# Altium schematic sheet Schematic_CNC.SchDoc
size A
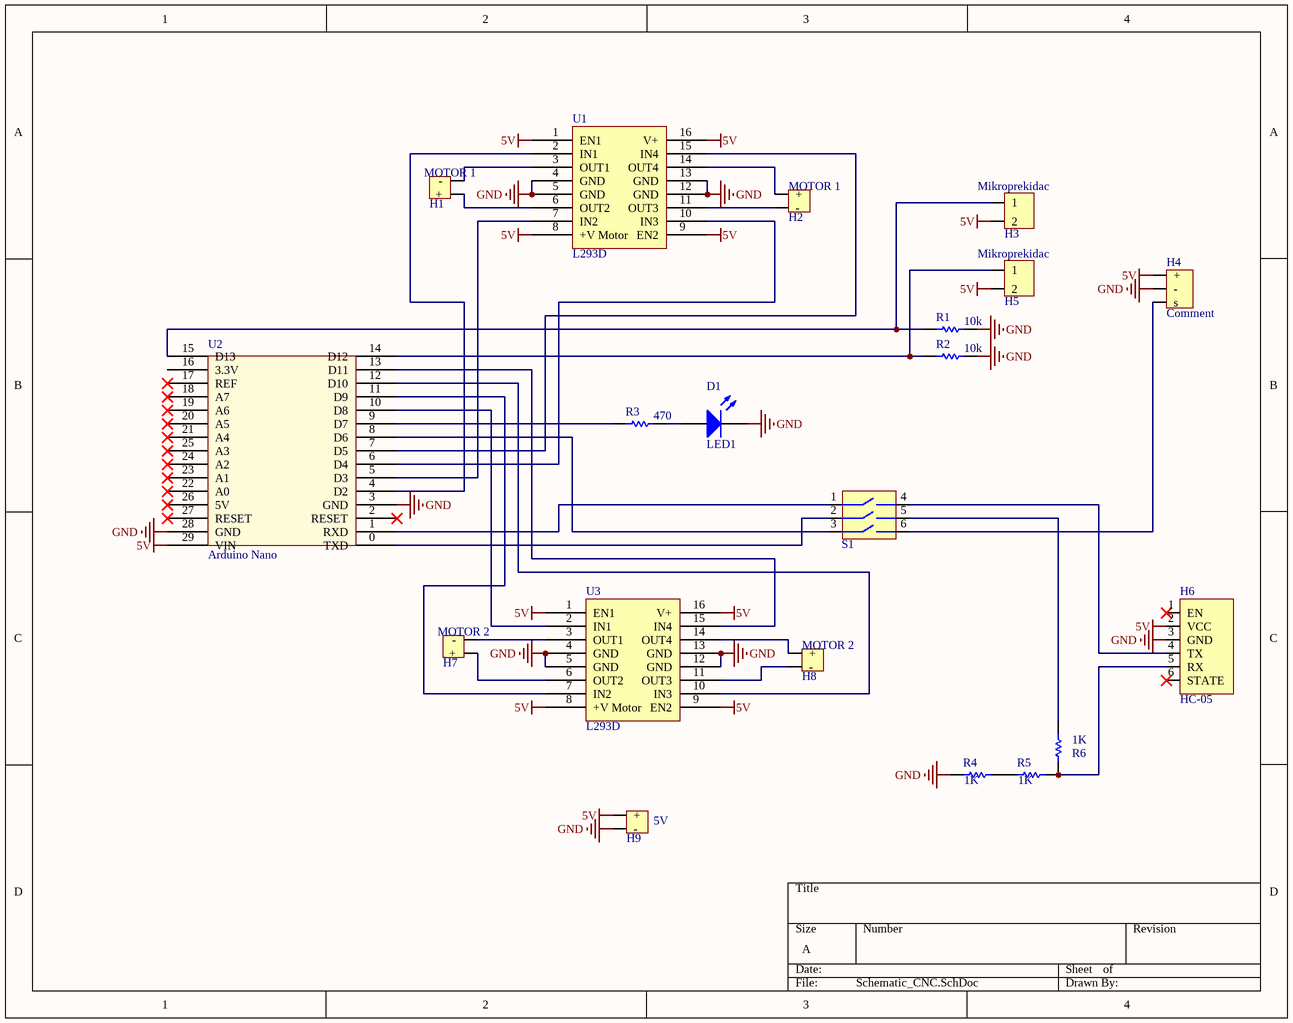
[diagram p0: Schematic_CNC.SchDoc]

## Parts
D1  LED1  [LED-1]
H1  MOTOR 1  [1x2 plavi sraf]
H2  MOTOR 1  [1x2 plavi sraf]
H3  Mikroprekidac  [1X2 HEADER]
H4  Comment  [1x3 plavi sraf]
H5  Mikroprekidac  [1X2 HEADER]
H6  HC-05  [HC-05]
H7  MOTOR 2  [1x2 plavi sraf]
H8  MOTOR 2  [1x2 plavi sraf]
H9  5V  [1x2 plavi sraf]
R1  value 10k  [AXIAL-0.3]  (hidden comment: Res1)
R2  value 10k  [AXIAL-0.3]  (hidden comment: Res1)
R3  value 470  [AXIAL-0.3]  (hidden comment: Res1)
R4  value 1K  [AXIAL-0.3]  (hidden comment: Res1)
R5  value 1K  [AXIAL-0.3]  (hidden comment: Res1)
R6  value 1K  [AXIAL-0.3]  (hidden comment: Res1)
S1  3X DIP Switch  [3X DIP SWITCH]  (value not drawn)
U1  L293D  [L293D]
U2  Arduino Nano  [Arduino nano]
U3  L293D  [L293D]

## Nets
5V: H3.2 H4.1(+) H5.2 H6.2(VCC) H9.1(+) U1.1(EN1) U1.8(+V_Motor) U1.9(EN2) U1.16(V+) U2.29(VIN) U3.1(EN1) U3.8(+V_Motor) U3.9(EN2) U3.16(V+)
GND: D1.2(K) H4.2(-) H6.3(GND) H9.2(-) R1.2 R2.2 R4.1 U1.4(GND) U1.5(GND) U1.12(GND) U1.13(GND) U2.3(GND) U2.28(GND) U3.4(GND) U3.5(GND) U3.12(GND) U3.13(GND)
NetD1_1: D1.1(A) R3.2
NetH1_1: H1.1(+) U1.6(OUT2)
NetH1_2: H1.2(-) U1.3(OUT1)
NetH2_1: H2.1(+) U1.14(OUT4)
NetH2_2: H2.2(-) U1.11(OUT3)
NetH3_1: H3.1 R1.1 U2.15(D13)
NetH4_3: H4.3(s) S1.6
NetH5_1: H5.1 R2.1 U2.14(D12)
NetH6_4: H6.4(TX) S1.4
NetH6_5: H6.5(RX) R5.2 R6.2
NetH7_1: H7.1(+) U3.6(OUT2)
NetH7_2: H7.2(-) U3.3(OUT1)
NetH8_1: H8.1(+) U3.14(OUT4)
NetH8_2: H8.2(-) U3.11(OUT3)
NetR3_1: R3.1 U2.9(D7)
NetR4_2: R4.2 R5.1
NetR6_1: R6.1 S1.5
NetS1_1: S1.1 U2.1(RXD)
NetS1_2: S1.2 U2.0(TXD)
NetS1_3: S1.3 U2.8(D6)
NetU1_2: U1.2(IN1) U2.4(D2)
NetU1_7: U1.7(IN2) U2.5(D3)
NetU1_10: U1.10(IN3) U2.6(D4)
NetU1_15: U1.15(IN4) U2.7(D5)
NetU2_10: U2.10(D8) U3.2(IN1)
NetU2_11: U2.11(D9) U3.7(IN2)
NetU2_12: U2.12(D10) U3.10(IN3)
NetU2_13: U2.13(D11) U3.15(IN4)

Not connected (* = marked no-connect by the designer): H6 1(EN)* 6(STATE)*; U2 2(RESET)* 16(3.3V) 17(REF)* 18(A7)* 19(A6)* 20(A5)* 21(A4)* 22(A0)* 23(A1)* 24(A2)* 25(A3)* 26(5V)* 27(RESET)*

## Library data of the parts
D1 = LED1: Typical RED GaAs LED; Published: 8-Jun-2000; LatestRevisionDate: 08-Jul-2005; LatestRevisionNote: Mech Layer 1 removed.; PackageReference: LED-1; Publisher: Altium Limited; PackageDescription: LED; 2 Leads
H1 H2 H7-H9 = 1x2 plavi sraf
H3 H5 = 1X2 HEADER
H4 = 1x3 plavi sraf
R1-R6 = Res1: Resistor; Published: 8-Jun-2000; LatestRevisionDate: 17-Jul-2002; LatestRevisionNote: Re-released for DXP Platform.; PackageReference: AXIAL-0.3; Publisher: Altium Limited; PackageDescription: Axial Device, Thru-Hole; 2 Leads; 0.3 in Pin Spacing
U1 U3 = L293D: Motor Driver
U2 = ArduinoNano